# Altium project PCB_Project.PrjPcb
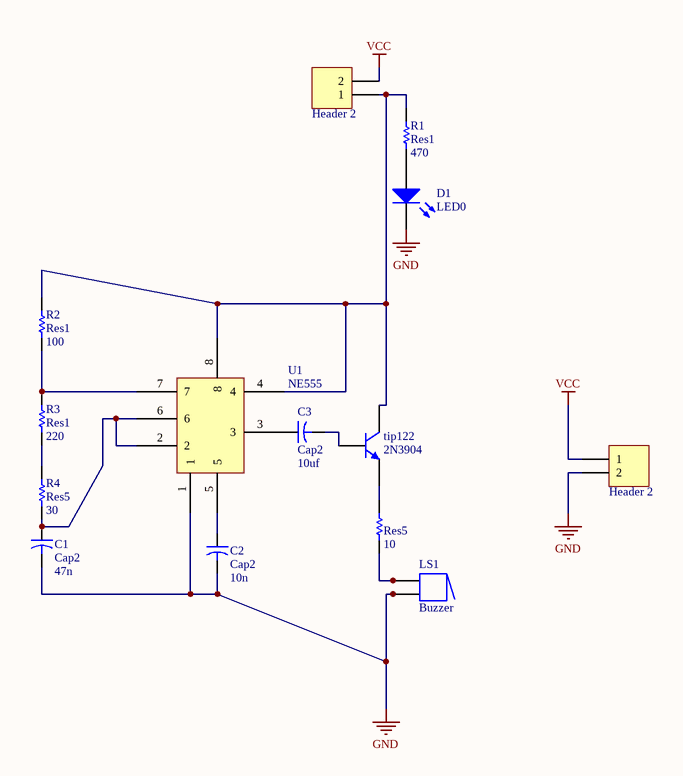
[diagram p0: Sheet2.SchDoc]
1 sheet, 14 parts. Net scope: global (net labels, ports and power ports of the same name join across sheets).
Board file: PCBm.PcbDoc

## Sheet Sheet2.SchDoc
size A

### Parts
C1  Cap2  value 47n  [CAPR5-4X5]
C2  Cap2  value 10n  [CAPR5-4X5]
C3  Cap2  value 10uf  [CAPR5-4X5]
D1  LED0  [LED-0]
LS1  Buzzer  [ABSM-1574]
P1  Header 2  [HDR1X2]
P2  Header 2  [HDR1X2]
R1  Res1  value 470  [AXIAL-0.3]
R2  Res1  value 100  [AXIAL-0.3]
R3  Res1  value 220  [AXIAL-0.3]
R4  Res5  value 30  [AXIAL-0.3]
tip122  2N3904  [TO-92A]
U1  NE555  [555]
  Res5  value 10  [AXIAL-0.3]

### Nets
GND: C1.2 C2.1 D1.2(K) LS1.2 LS1.2A P1.2 U1.1
VCC: P1.1 P2.2
NetC1_1: C1.1 R4.1 U1.2 U1.6
NetC2_2: C2.2 U1.5
NetC3_1: C3.1 U1.3
NetC3_2: C3.2 tip122.2(B)
NetD1_1: D1.1(A) R1.1
NetLS1_1: LS1.1 LS1.1A .1
NetP2_1: P2.1 R1.2 R2.2 tip122.3(C) U1.4 U1.8
NetR2_1: R2.1 R3.2 U1.7
NetR3_1: R3.1 R4.2
Nettip122_1: tip122.1(E) .2

### Library data of the parts
C1-C3 = Cap2: Capacitor; Published: 23-Sep-2002; PackageReference: CAPR5-4X5; Publisher: Altium Limited; PackageDescription: Capacitor; 2 Leads
D1 = LED0: Typical INFRARED GaAs LED; Published: 8-Jun-2000; LatestRevisionDate: 08-Jul-2005; LatestRevisionNote: Mech Layer 1 removed.; PackageReference: LED-0; Publisher: Altium Limited; PackageDescription: LED; 2 Leads
LS1 = Buzzer: Magnetic Transducer Buzzer; Published: 24-Mar-1999; LatestRevisionDate: 17-Dec-2003; LatestRevisionNote: Schematic revised, PCB Footprint replaced.; DatasheetVersion: 17-Dec-2003; PackageReference: ABSM-1574; Publisher: Altium Limited; PackageDescription: Magnetic Transducer Buzzer; ComponentLink1Description: Manufacturer Link; ComponentLink1URL: http://www.megastar.com/linecard/buzzmode/index.php
P1 P2 = Header 2: Header, 2-Pin
R1-R4  = Res1: Resistor
tip122 = 2N3904: NPN General Purpose Amplifier; Published: 8-Jun-2000; LatestRevisionDate: 15-Jan-2003; LatestRevisionNote: PCB Footprint 'BCY-W3/D4.7' replaced; DatasheetVersion: 1997; PackageVersion: Sep-1998; PackageReference: TO-92A; Publisher: Altium Limited; PackageDescription: TO, Flat Index; 3 In-Line, Axial Leads; Body Dia. 4.5mm; Leads 0.51 x 0.48 mm (max); ComponentLink1Description: Manufacturer Link; ComponentLink1URL: http://www.fairchildsemi.com/; ComponentLink2Description: Datasheet; ComponentLink2URL: http://www.fairchildsemi.com/ds/2N%2F2N3904.pdf
U1 = 555